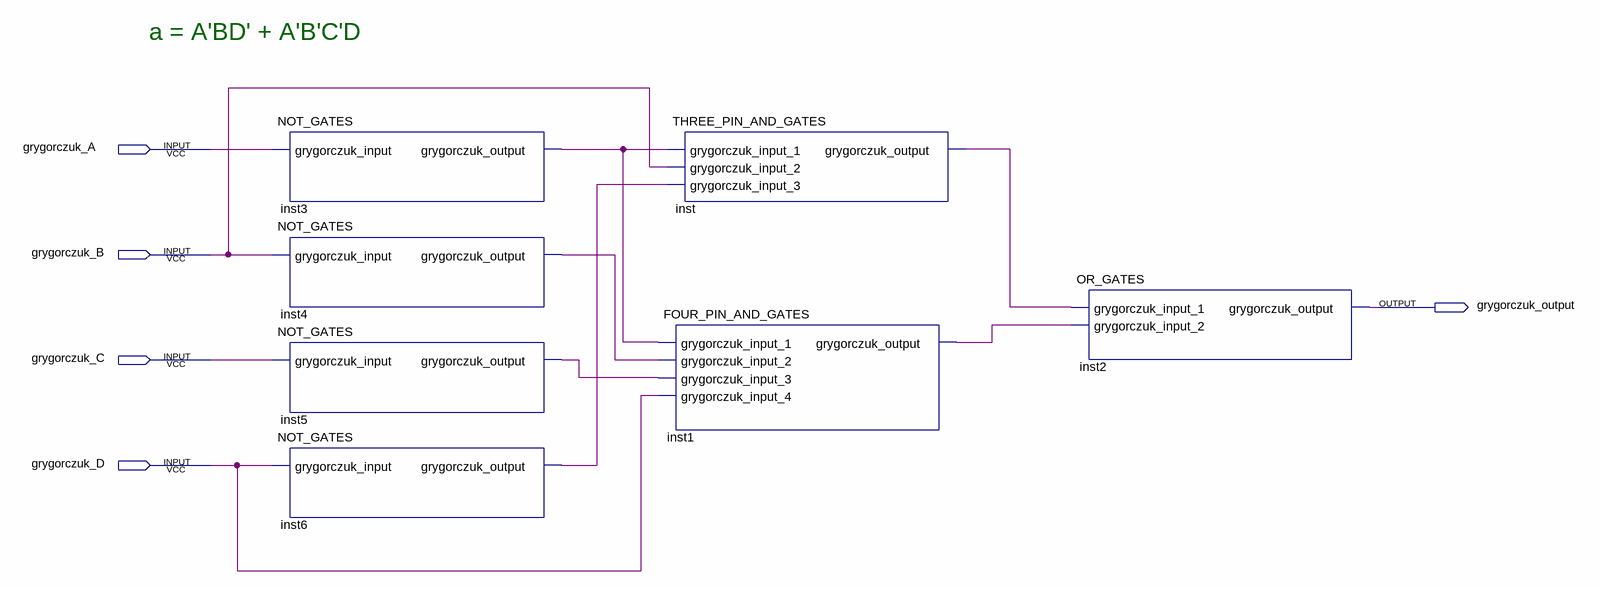
[diagram p0: schematic sheet]
// Quartus schematic SEVEN_SEGMENT_DISPLAY_NAND_A.bdf as structural Verilog: 7 symbols, 5 pins
module SEVEN_SEGMENT_DISPLAY_NAND_A (
  input  grygorczuk_A,
  input  grygorczuk_B,
  input  grygorczuk_C,
  input  grygorczuk_D,
  output grygorczuk_output
);

  wire inst1_grygorczuk_output, inst3_grygorczuk_output, inst4_grygorczuk_output, inst5_grygorczuk_output,
       inst6_grygorczuk_output, inst_grygorczuk_output;

  NOT_GATES inst3 (.grygorczuk_input(grygorczuk_A), .grygorczuk_output(inst3_grygorczuk_output));
  NOT_GATES inst4 (.grygorczuk_input(grygorczuk_B), .grygorczuk_output(inst4_grygorczuk_output));
  NOT_GATES inst5 (.grygorczuk_input(grygorczuk_C), .grygorczuk_output(inst5_grygorczuk_output));
  NOT_GATES inst6 (.grygorczuk_input(grygorczuk_D), .grygorczuk_output(inst6_grygorczuk_output));
  THREE_PIN_AND_GATES inst (
    .grygorczuk_input_1(inst3_grygorczuk_output), .grygorczuk_input_2(grygorczuk_B),
    .grygorczuk_input_3(inst6_grygorczuk_output), .grygorczuk_output(inst_grygorczuk_output));
  FOUR_PIN_AND_GATES inst1 (
    .grygorczuk_input_1(inst3_grygorczuk_output), .grygorczuk_input_2(inst4_grygorczuk_output),
    .grygorczuk_input_3(inst5_grygorczuk_output), .grygorczuk_input_4(grygorczuk_D),
    .grygorczuk_output(inst1_grygorczuk_output));
  OR_GATES inst2 (
    .grygorczuk_input_1(inst_grygorczuk_output), .grygorczuk_input_2(inst1_grygorczuk_output),
    .grygorczuk_output(grygorczuk_output));

  // Notes on the sheet:
  //   a = A'BD' + A'B'C'D
endmodule
